# EasyEDA Pro project BLDCV6-nerdyintern.eprj, board PCB1
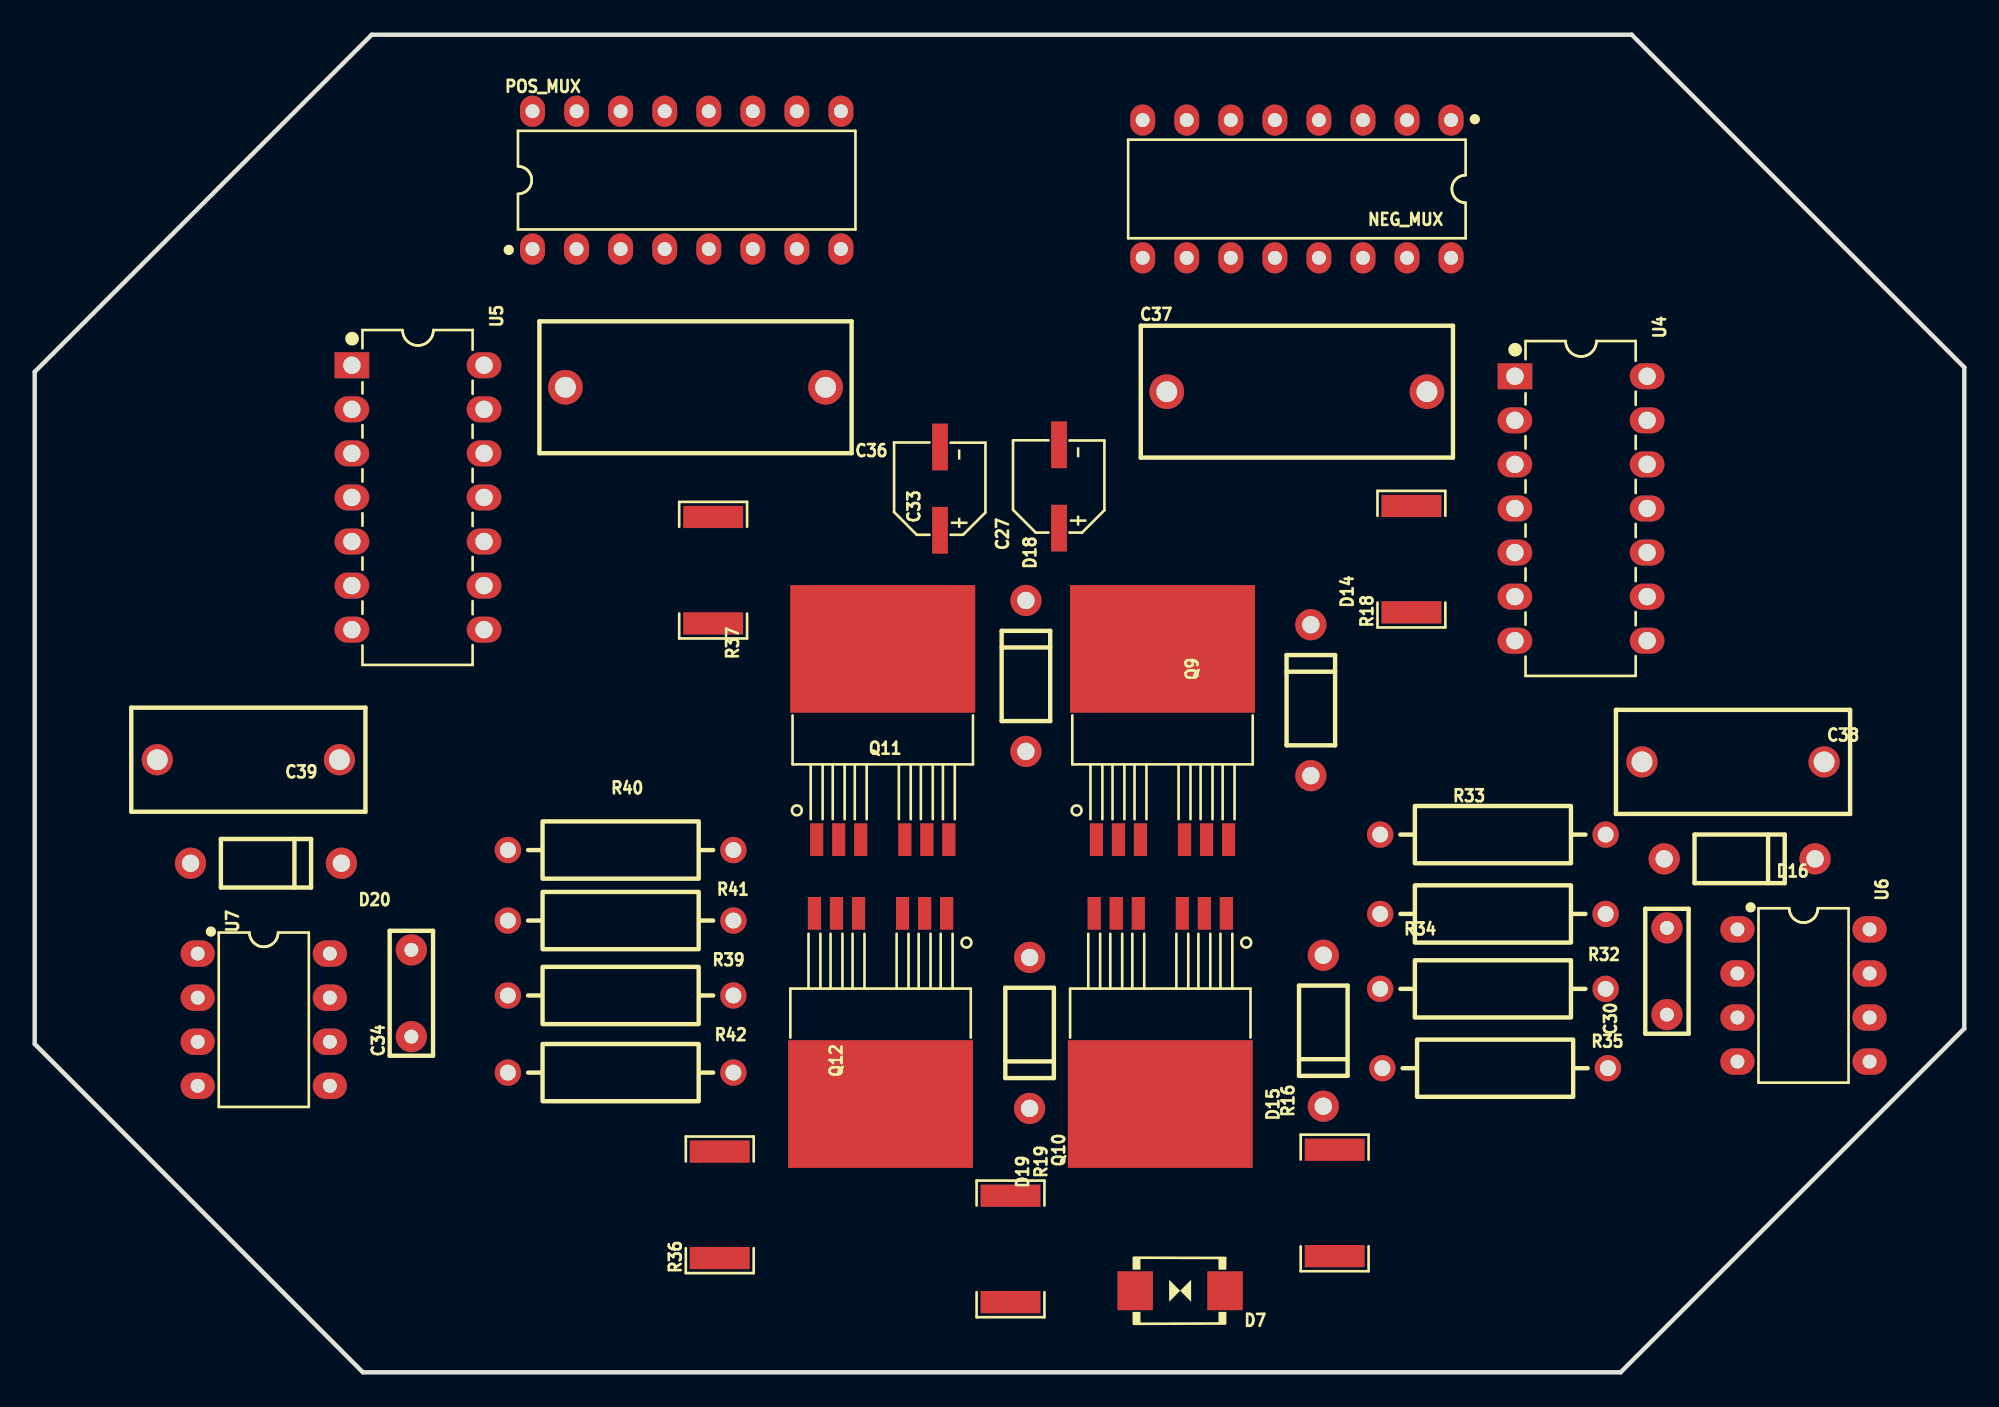
[diagram p5: board, top side]
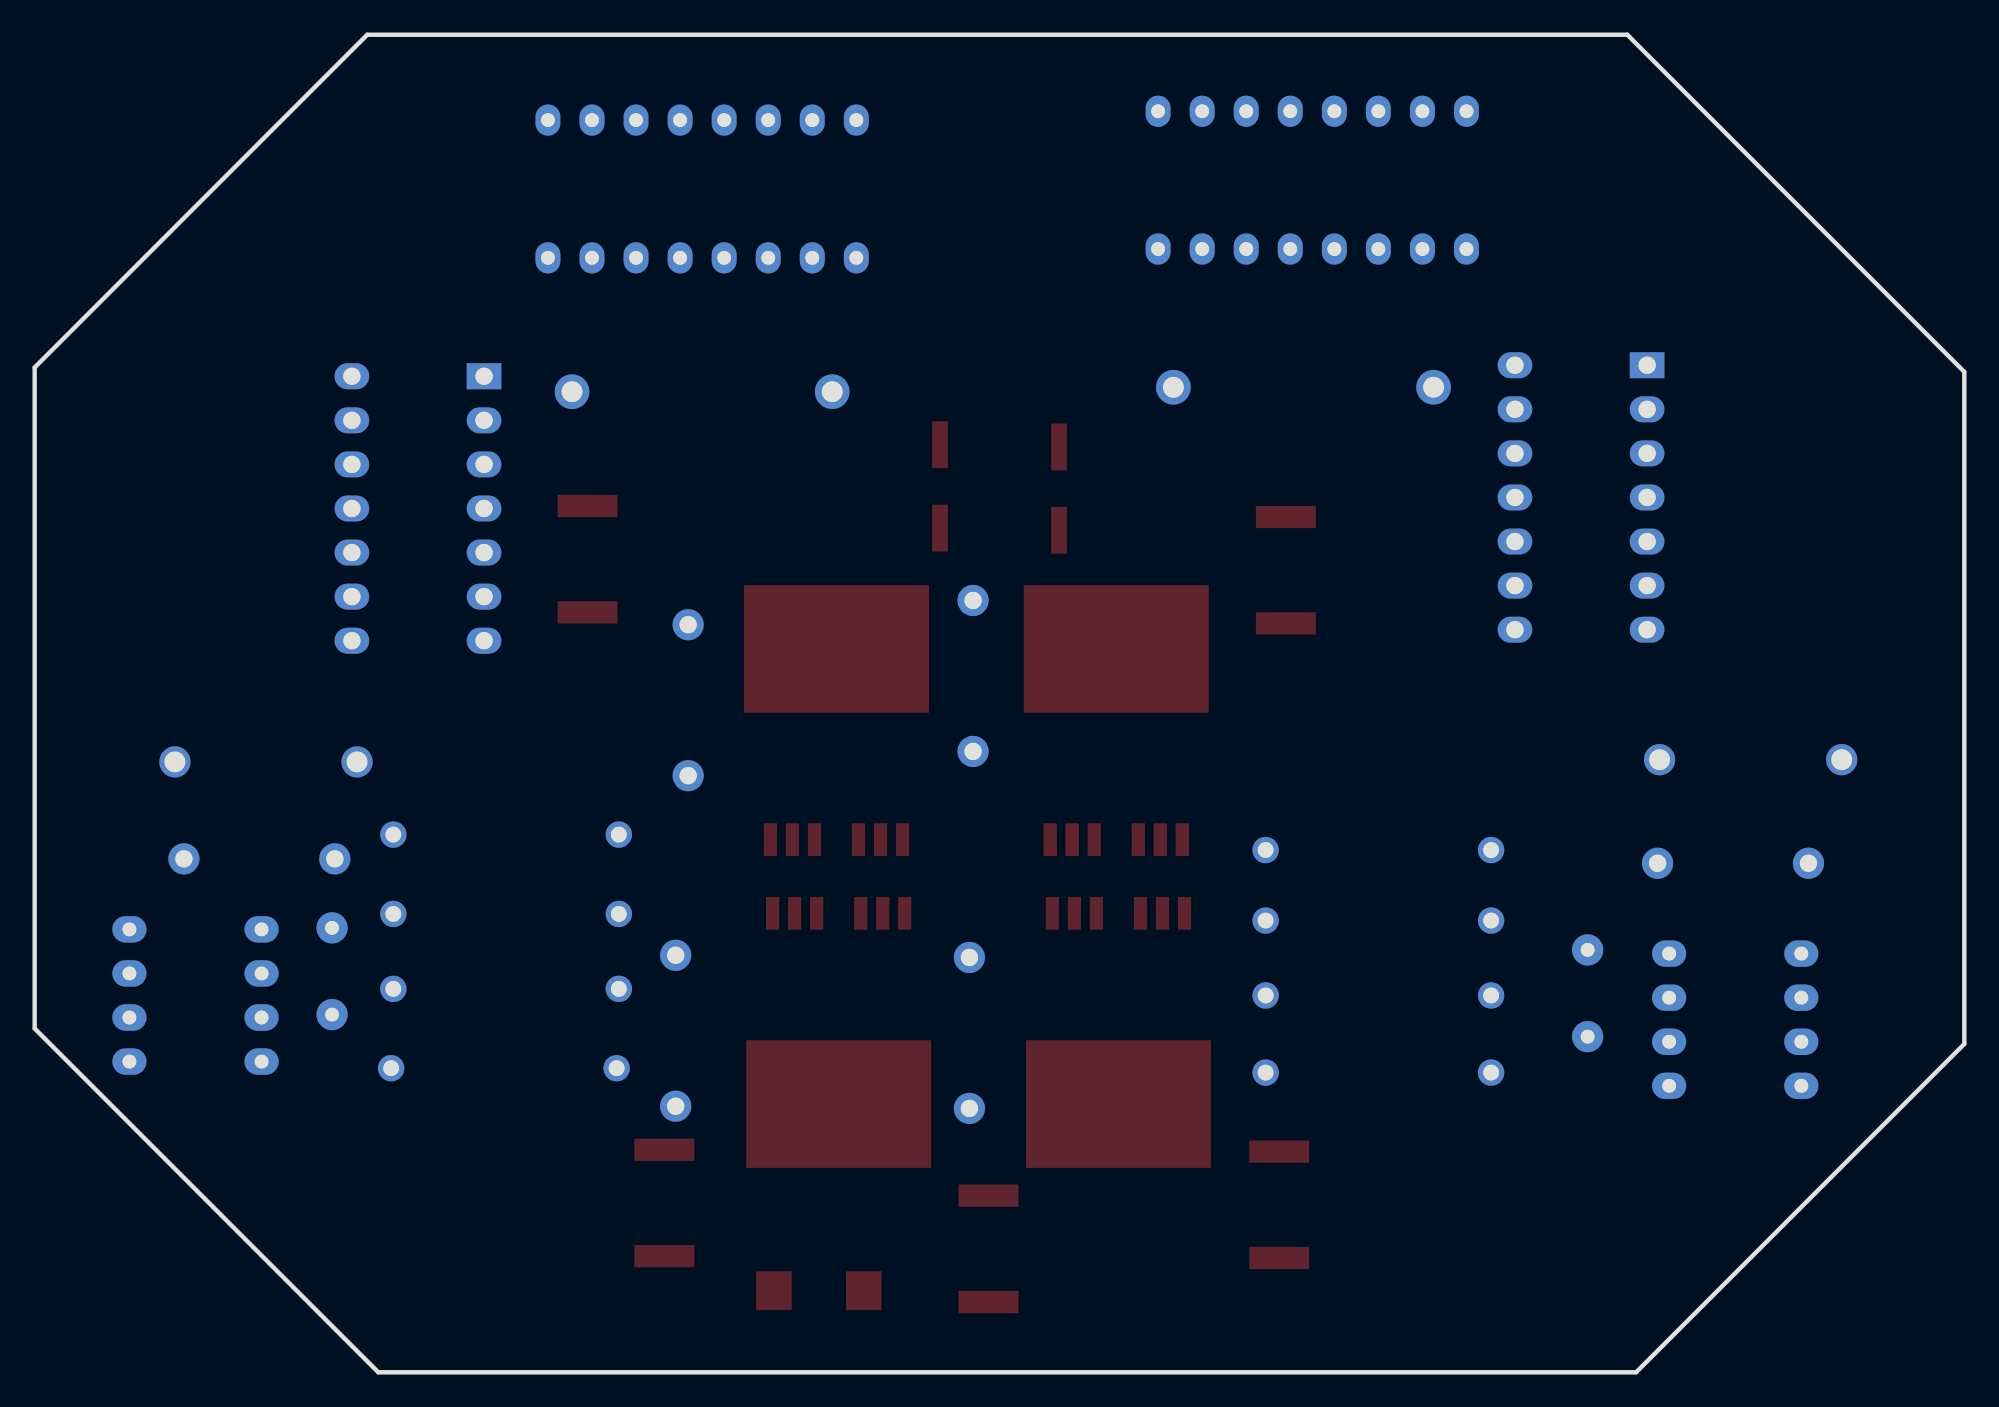
[diagram p6: board, bottom side, seen from below]

Outline 111.25 x 77.09 mm; copper layers: Top Layer, Bottom Layer. Coordinates in mm from the lower left corner of the outline.
Outline path: 0,57.66 0,18.92 18.92,0 91.44,0 111.25,19.81 111.25,57.91 92.07,77.09 19.43,77.09 0,57.66
Stack: Top Layer 0.035mm / Dielectric1 1.51mm FR4 er 4.5 / Bottom Layer 0.035mm

## Design rules (mm)
template: JLCPCB Capability(Two Layers Board)
spacing copperThickness1oz (default): track to track 0.102, other pairs 0.152 to 0.3
spacing copperThickness2oz: track to track 0.203, other pairs 0.152 to 0.3
track width copperThickness1oz (default): min 0.127, default 0.254, max 2.54
track width copperThickness2oz: min 0.203, default 0.254, max 2.54
differential pair differentialPair (default): width min 0.127, default 0.254, max 2.54; gap min 0.152, default 0.152
via viaSize (default): diameter min 0.5, default 0.61, max 10; hole min 0.3, default 0.305, max 6.3

## Placement (name value [footprint] x y rotation side)
C27  10uF  [CAP-SMD_BD5.0-L5.3-W5.3-LS6.3-FD]  59.06 51.05 90 top
C30  1uF  [CAP-TH_L7.2-W2.5-P5.00-D0.6]  94.11 23.11 90 top
C33  10uF  [CAP-SMD_BD5.0-L5.3-W5.3-LS6.3-FD]  52.2 50.93 90 top
C34  1uF  [CAP-TH_L7.2-W2.5-P5.00-D0.6]  21.72 21.84 90 top
C36  330nF  [CAP-TH_L18.0-W7.5-P15.00-D0.8]  38.1 56.77 180 top
C37  330nF  [CAP-TH_L18.0-W7.5-P15.00-D0.8]  72.77 56.52 0 top
C38  15nF  [CAP-TH_L13.5-W5.5-P10.50-D1.2]  97.92 35.18 0 top
C39  15nF  [CAP-TH_L13.5-W5.5-P10.50-D1.2]  12.32 35.31 180 top
D7  P6SMB6.8CA/TR13  [SMB_L4.6-W3.6-LS5.3-BI]  66.04 4.7 180 top
D14  -  [DO-41_BD2.4-L4.7-P8.70-D0.9-RD]  73.58 38.73 270 top
D15  -  [DO-41_BD2.4-L4.7-P8.70-D0.9-RD]  74.29 19.69 90 top
D16  -  [DO-41_BD2.4-L4.7-P8.70-D0.9-RD]  98.3 29.59 180 top
D18  -  [DO-41_BD2.4-L4.7-P8.70-D0.9-RD]  57.15 40.13 270 top
D19  -  [DO-41_BD2.4-L4.7-P8.70-D0.9-RD]  57.36 19.56 90 top
D20  -  [DO-41_BD2.4-L4.7-P8.70-D0.9-RD]  13.33 29.34 180 top
NEG_MUX  74HC4051N  [PDIP-16_L19.3-W6.4-P2.54-LS7.94-BL]  72.77 68.2 180 top
POS_MUX  74HC4051N  [PDIP-16_L19.3-W6.4-P2.54-LS7.94-BL]  37.59 68.71 0 top
Q9  IRFS7530TRL7PP  [D2PAK-7_L10.6-W9.6-P1.27-LS15.9-BR]  65.02 36.2 270 top
Q10  IRFS7530TRL7PP  [D2PAK-7_L10.6-W9.6-P1.27-LS15.9-BR]  64.9 20.95 90 top
Q11  IRFS7530TRL7PP  [D2PAK-7_L10.6-W9.6-P1.27-LS15.9-BR]  48.9 36.2 270 top
Q12  IRFS7530TRL7PP  [D2PAK-7_L10.6-W9.6-P1.27-LS15.9-BR]  48.77 20.95 90 top
R16  5mΩ  [R2512]  74.95 9.76 90 top
R18  5mΩ  [R2512]  79.38 46.86 90 top
R19  5mΩ  [R2512]  56.26 7.11 270 top
R32  [6-10]  [RES-TH_BD3.3-L9.0-P13.00-D0.6]  84.07 22.1 180 top
R33  [6-10]  [RES-TH_BD3.3-L9.0-P13.00-D0.6]  84.07 30.99 0 top
R34  10k  [RES-TH_BD3.3-L9.0-P13.00-D0.6]  84.07 26.42 0 top
R35  10k  [RES-TH_BD3.3-L9.0-P13.00-D0.6]  84.2 17.53 0 top
R36  5mΩ  [R2512]  39.5 9.65 90 top
R37  5mΩ  [R2512]  39.12 46.23 90 top
R39  [6-10]  [RES-TH_BD3.3-L9.0-P13.00-D0.6]  33.78 21.72 0 top
R40  [6-10]  [RES-TH_BD3.3-L9.0-P13.00-D0.6]  33.78 30.1 180 top
R41  10k  [RES-TH_BD3.3-L9.0-P13.00-D0.6]  33.78 26.04 180 top
R42  10k  [RES-TH_BD3.3-L9.0-P13.00-D0.6]  33.78 17.27 180 top
U4  LM324N  [DIP-14_L19.3-W7.0-P2.54-LS7.6-BL]  89.15 49.78 270 top
U5  LM324N  [DIP-14_L19.3-W7.0-P2.54-LS7.6-BL]  22.1 50.42 270 top
U6  IR2104PBF  [DIP-8_L9.9-W6.6-P2.54-LS7.62-BL]  101.98 21.72 270 top
U7  IR2104PBF  [DIP-8_L9.9-W6.6-P2.54-LS7.62-BL]  13.21 20.32 270 top

## Footprints (pads in the part's own frame, mm; a bottom-side part is the same pattern mirrored in y, then rotated)
CAP-SMD_BD5.0-L5.3-W5.3-LS6.3-FD
  rect 2.7x0.91 smd: 1(-2.4,0) 2(2.4,0)
CAP-TH_L7.2-W2.5-P5.00-D0.6
  round 1.8 hole 0.8: 1(-2.499,0) 2(2.499,0)
CAP-TH_L13.5-W5.5-P10.50-D1.2
  round 1.8 hole 1.2: 1(-5.25,0) 2(5.25,0)
CAP-TH_L18.0-W7.5-P15.00-D0.8
  round 2 hole 1.2: 1(-7.5,0) 2(7.5,0)
D2PAK-7_L10.6-W9.6-P1.27-LS15.9-BR
  rect 1.887x0.762 smd: 1(5.495,-3.81) 2(5.495,-2.54) 3(5.495,-1.27) 5(5.495,1.27) 6(5.495,2.54) 7(5.495,3.81)
  rect 7.356x10.66 smd: 4(-5.495,0)
DIP-8_L9.9-W6.6-P2.54-LS7.62-BL
  oval 1.524x1.97 hole 0.8: 1(-3.81,-3.81) 2(-1.27,-3.81) 3(1.27,-3.81) 4(3.81,-3.81) 5(3.81,3.81) 6(1.27,3.81) 7(-1.27,3.81) 8(-3.81,3.81)
DIP-14_L19.3-W7.0-P2.54-LS7.6-BL
  rect 1.5x2 hole 1: 1(-7.62,-3.81)
  oval 1.5x2 hole 1: 2(-5.08,-3.81) 3(-2.54,-3.81) 4(0,-3.81) 5(2.54,-3.81) 6(5.08,-3.81) 7(7.62,-3.81) 8(7.62,3.81) 9(5.08,3.81) 10(2.54,3.81) 11(0,3.81) 12(-2.54,3.81) 13(-5.08,3.81) 14(-7.62,3.81)
DO-41_BD2.4-L4.7-P8.70-D0.9-RD
  round 1.8 hole 1: 1(-4.35,0) 2(4.35,0)
PDIP-16_L19.3-W6.4-P2.54-LS7.94-BL
  oval 1.44x1.8 hole 0.8: 1(-8.89,-3.97) 2(-6.35,-3.97) 3(-3.81,-3.97) 4(-1.27,-3.97) 5(1.27,-3.97) 6(3.81,-3.97) 7(6.35,-3.97) 8(8.89,-3.97) 9(8.89,3.97) 10(6.35,3.97) 11(3.81,3.97) 12(1.27,3.97) 13(-1.27,3.97) 14(-3.81,3.97) 15(-6.35,3.97) 16(-8.89,3.97)
R2512
  rect 1.282x3.456 smd: 1(-3.067,0) 2(3.067,0)
RES-TH_BD3.3-L9.0-P13.00-D0.6
  round 1.524 hole 0.914: 1(-6.5,0) 2(6.5,0)
SMB_L4.6-W3.6-LS5.3-BI
  rect 2.047x2.241 smd: 1(-2.591,0) 2(2.591,0)

## Nets
As in the schematic.

Pads without a net: D15 2; NEG_MUX 1 2 3 4 5 6 7 8 9 10 11 12 13 14 15 16; POS_MUX 1 2 3 4 5 6 7 8 9 10 11 12 13 14 15 16; U4 1 2 3 4 5 6 7 8 9 10 11 12 13 14; U5 1 2 3 4 5 6 7 8 9 10 11 12 13 14
